# Altium schematic sheet 03-MCU_INTERFACE.SchDoc
size A3
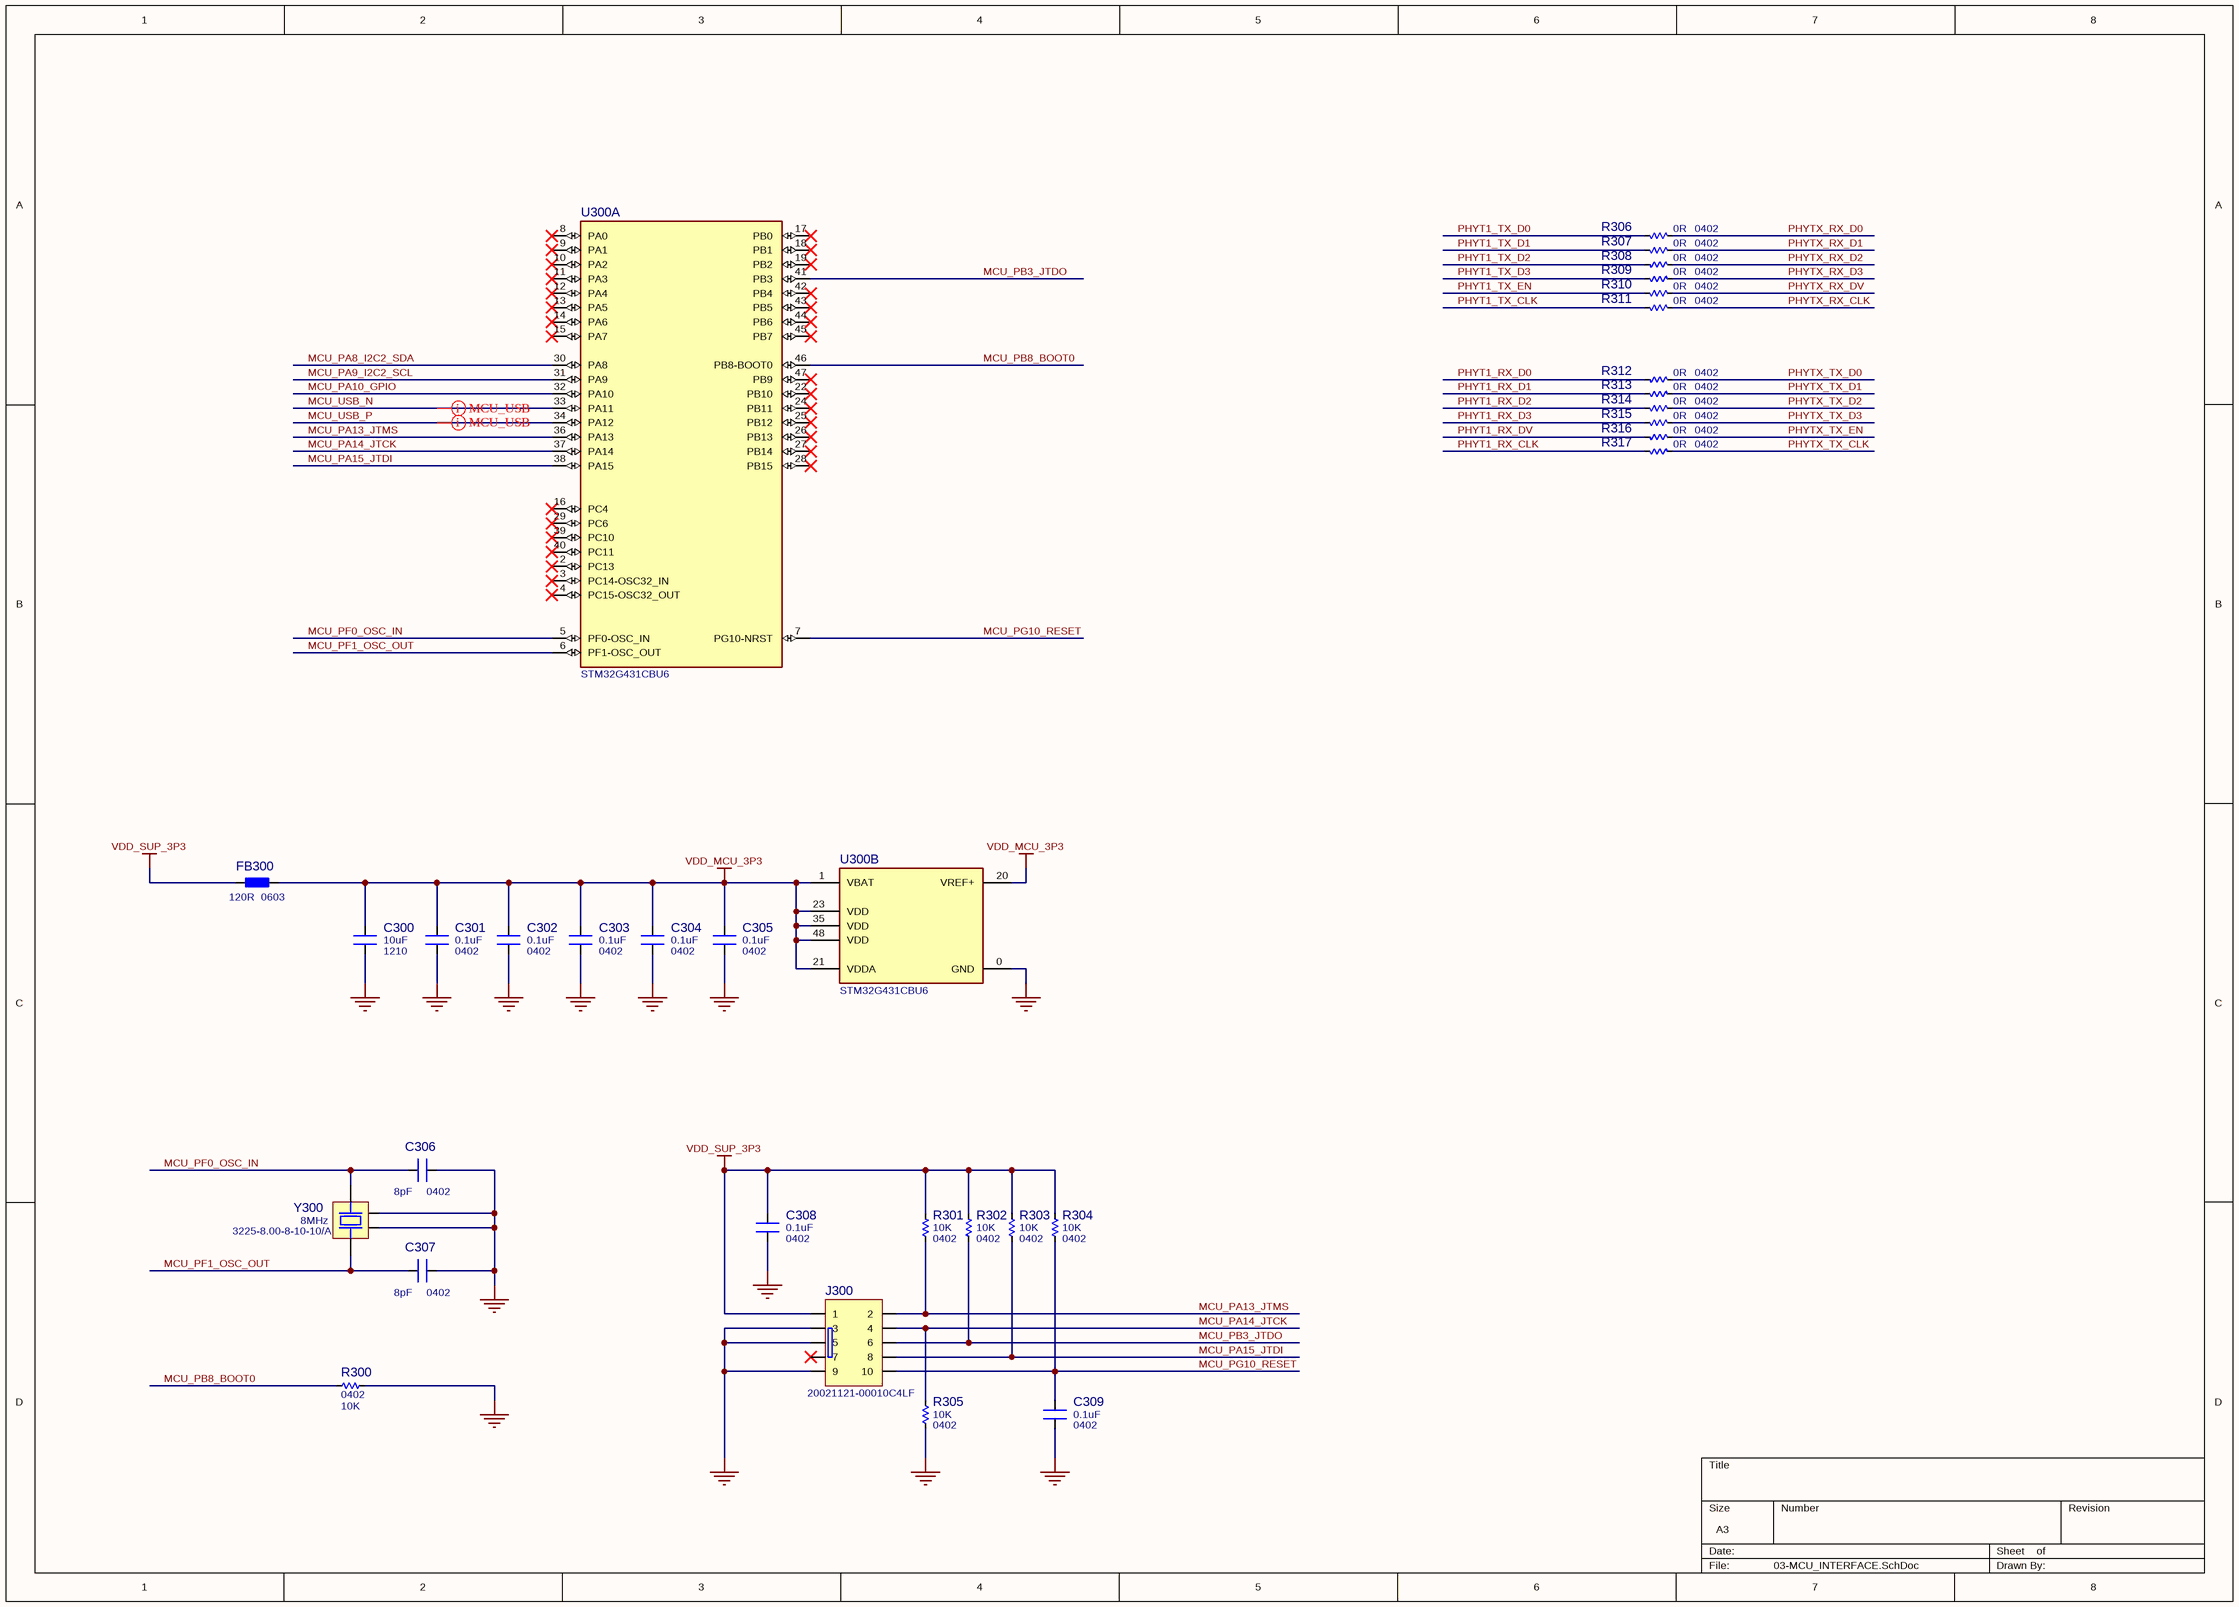
[diagram p0: 03-MCU_INTERFACE.SchDoc]

## Parts
C300  value 10uF  Package: 1210  [CAP_C_1210]  (hidden comment: Capacitor NP)
C301  value 0.1uF  Package: 0402  [CAP_C_0402]  (hidden comment: Capacitor NP)
C302  value 0.1uF  Package: 0402  [CAP_C_0402]  (hidden comment: Capacitor NP)
C303  value 0.1uF  Package: 0402  [CAP_C_0402]  (hidden comment: Capacitor NP)
C304  value 0.1uF  Package: 0402  [CAP_C_0402]  (hidden comment: Capacitor NP)
C305  value 0.1uF  Package: 0402  [CAP_C_0402]  (hidden comment: Capacitor NP)
C306  value 8pF  Package: 0402  [CAP_C_0402]  (hidden comment: Capacitor NP)
C307  value 8pF  Package: 0402  [CAP_C_0402]  (hidden comment: Capacitor NP)
C308  value 0.1uF  Package: 0402  [CAP_C_0402]  (hidden comment: Capacitor NP)
C309  value 0.1uF  Package: 0402  [CAP_C_0402]  (hidden comment: Capacitor NP)
FB300  value 120R  Package: 0603  [IND_C_0603]  (hidden comment: Ferrite bead)
J300  Manufacturer Part Number: 20021121-00010C4LF  [IDE_1.27-SMD-10V_2]  (hidden comment: IDE_10P)
R300  value 10K  Package: 0402  [RES_C_0402]  (hidden comment: Resistor)
R301  value 10K  Package: 0402  [RES_C_0402]  (hidden comment: Resistor)
R302  value 10K  Package: 0402  [RES_C_0402]  (hidden comment: Resistor)
R303  value 10K  Package: 0402  [RES_C_0402]  (hidden comment: Resistor)
R304  value 10K  Package: 0402  [RES_C_0402]  (hidden comment: Resistor)
R305  value 10K  Package: 0402  [RES_C_0402]  (hidden comment: Resistor)
R306  value 0R  Package: 0402  [RES_C_0402]  (hidden comment: Resistor)
R307  value 0R  Package: 0402  [RES_C_0402]  (hidden comment: Resistor)
R308  value 0R  Package: 0402  [RES_C_0402]  (hidden comment: Resistor)
R309  value 0R  Package: 0402  [RES_C_0402]  (hidden comment: Resistor)
R310  value 0R  Package: 0402  [RES_C_0402]  (hidden comment: Resistor)
R311  value 0R  Package: 0402  [RES_C_0402]  (hidden comment: Resistor)
R312  value 0R  Package: 0402  [RES_C_0402]  (hidden comment: Resistor)
R313  value 0R  Package: 0402  [RES_C_0402]  (hidden comment: Resistor)
R314  value 0R  Package: 0402  [RES_C_0402]  (hidden comment: Resistor)
R315  value 0R  Package: 0402  [RES_C_0402]  (hidden comment: Resistor)
R316  value 0R  Package: 0402  [RES_C_0402]  (hidden comment: Resistor)
R317  value 0R  Package: 0402  [RES_C_0402]  (hidden comment: Resistor)
U300  STM32G431CBU6  [QFN50P700X700X100_HS-49N]  (parts A,B of 2)
Y300  Manufacturer Part Number: 3225-8.00-8-10-10/A  Frequency: 8MHz  [XT-SMD-3225-4P]  (hidden comment: Crystal)

## Nets
GND: C300.1 C301.1 C302.1 C303.1 C304.1 C305.1 C306.1 C307.1 C308.1 C309.1 J300.3 J300.5 J300.9 R300.2 R305.2 U300.0(GND) Y300.2 Y300.4
VDD_MCU_3P3: C300.2 C301.2 C302.2 C303.2 C304.2 C305.2 FB300.1 U300.1(VBAT) U300.20(VREF+) U300.21(VDDA) U300.23(VDD) U300.35(VDD) U300.48(VDD)
VDD_SUP_3P3: C308.2 FB300.2 J300.1 R301.1 R302.1 R303.1 R304.1
MCU_PA8_I2C2_SDA: U300.30(PA8)
MCU_PA9_I2C2_SCL: U300.31(PA9)
MCU_PA10_GPIO: U300.32(PA10)
MCU_PA13_JTMS: J300.2 R301.2 U300.36(PA13)
MCU_PA14_JTCK: J300.4 R305.1 U300.37(PA14)
MCU_PA15_JTDI: J300.8 R303.2 U300.38(PA15)
MCU_PB3_JTDO: J300.6 R302.2 U300.41(PB3)
MCU_PB8_BOOT0: R300.1 U300.46(PB8-BOOT0)
MCU_PF0_OSC_IN: C306.2 U300.5(PF0-OSC_IN) Y300.1
MCU_PF1_OSC_OUT: C307.2 U300.6(PF1-OSC_OUT) Y300.3
MCU_PG10_RESET: C309.2 J300.10 R304.2 U300.7(PG10-NRST)
MCU_USB_N: U300.33(PA11)
MCU_USB_P: U300.34(PA12)
PHYT1_RX_CLK: R317.2
PHYT1_RX_D0: R312.2
PHYT1_RX_D1: R313.2
PHYT1_RX_D2: R314.2
PHYT1_RX_D3: R315.2
PHYT1_RX_DV: R316.2
PHYT1_TX_CLK: R311.2
PHYT1_TX_D0: R306.2
PHYT1_TX_D1: R307.2
PHYT1_TX_D2: R308.2
PHYT1_TX_D3: R309.2
PHYT1_TX_EN: R310.2
PHYTX_RX_CLK: R311.1
PHYTX_RX_D0: R306.1
PHYTX_RX_D1: R307.1
PHYTX_RX_D2: R308.1
PHYTX_RX_D3: R309.1
PHYTX_RX_DV: R310.1
PHYTX_TX_CLK: R317.1
PHYTX_TX_D0: R312.1
PHYTX_TX_D1: R313.1
PHYTX_TX_D2: R314.1
PHYTX_TX_D3: R315.1
PHYTX_TX_EN: R316.1

Not connected (* = marked no-connect by the designer): J300 7*; U300 2(PC13)* 3(PC14-OSC32_IN)* 4(PC15-OSC32_OUT)* 8(PA0)* 9(PA1)* 10(PA2)* 11(PA3)* 12(PA4)* 13(PA5)* 14(PA6)* 15(PA7)* 16(PC4)* 17(PB0)* 18(PB1)* 19(PB2)* 22(PB10)* 24(PB11)* 25(PB12)* 26(PB13)* 27(PB14)* 28(PB15)* 29(PC6)* 39(PC10)* 40(PC11)* 42(PB4)* 43(PB5)* 44(PB6)* 45(PB7)* 47(PB9)*

## Layout directives
differential pair; net class NC_DIFFPAIR_90R_USB; differential pair class DIFFPAIR_90R_USB: MCU_USB_N, MCU_USB_P

## Library data of the parts
C300 = Cap: Ceramic Capacitor SMD 1210 10uF ±10% 25V; Manufacturer: Samsung; Manufacturer Part Number: CL32B106KAJNNNE; Temperature Coeffcient: -55 to 85℃; Revision: 0; Tolerance: ±10%; ComponentLink1URL: http://product.samsungsem.com/mlcc/CL05A105KA5NQN.do; ComponentLink1Description: SVN Datasheet; ComponentLink2URL: *; ComponentLink2Description: Local Datasheet; ComponentLink3URL: D:\Altium\Library\AS50 library\AS50.SchLib; ComponentLink3Description: Open Symbol; ComponentLink4URL: D:\Altium\Library\AS50 library\Capacitors.PcbLib; ComponentLink4Description: Open Footprint; ComponentLink5Description: Open Footprint 2; ComponentLink6Description: Open Footprint 3; ComponentLink7Description: Open Footprint 4; Category: Capacitor; Voltage: 25V; Supplier 1: LCSC; Supplier Part Number 1: C39232
C301-C305 C308 C309 = Cap: Ceramic Capacitor SMD 0402 100nF ±10% 16V; Manufacturer: Samsung; Manufacturer Part Number: CL05B104KO5NNNC; Temperature Coeffcient: -55 to 85℃; Revision: 0; Tolerance: ±10%; ComponentLink1URL: http://product.samsungsem.com/mlcc/CL05B104KO5NNN.do; ComponentLink1Description: SVN Datasheet; ComponentLink2URL: *; ComponentLink2Description: Local Datasheet; ComponentLink3URL: D:\Altium\Library\AS50 library\AS50.SchLib; ComponentLink3Description: Open Symbol; ComponentLink4URL: D:\Altium\Library\AS50 library\Capacitors.PcbLib; ComponentLink4Description: Open Footprint; ComponentLink5Description: Open Footprint 2; ComponentLink6Description: Open Footprint 3; ComponentLink7Description: Open Footprint 4; Category: Capacitor; Voltage: 16V; Supplier 1: LCSC; Supplier Part Number 1: C1525
C306 C307 = Cap: Ceramic Capacitor SMD 0402 8pF ±0.25pF 50V; Manufacturer: Yageo; Manufacturer Part Number: CC0402CRNPO9BN8R0; Temperature Coeffcient: -55 to 85℃; Revision: 0; Tolerance: ±0.25pF; ComponentLink1URL: https://www.yageo.com/upload/media/product/products/datasheet/mlcc/UPY-GP_NP0_16V-to-50V_18.pdf; ComponentLink1Description: SVN Datasheet; ComponentLink2URL: *; ComponentLink2Description: Local Datasheet; ComponentLink3URL: D:\Altium\Library\AS50 library\AS50.SchLib; ComponentLink3Description: Open Symbol; ComponentLink4URL: D:\Altium\Library\AS50 library\Capacitors.PcbLib; ComponentLink4Description: Open Footprint; ComponentLink5Description: Open Footprint 2; ComponentLink6Description: Open Footprint 3; ComponentLink7Description: Open Footprint 4; Category: Capacitor; Voltage: 50V; Supplier 1: LCSC; Supplier Part Number 1: C130118
FB300 = Ferrite bead: Ferrite bead SMD 0603 120Ω ±25% @ 100MHz DCR=0.03Ω 3A; Manufacturer: Murata Electronics; Manufacturer Part Number: BLM18KG121TH1D; Category: Ferrite Bead; Tolerance: 25%; Frequency: 100MHz; DC Current: 3A; ComponentLink1URL: https://www.sunlordinc.com/Download.aspx?file=L1VwbG9hZEZpbGVzL1BERl9DYXQvMjAyMTA5MDcxNDU1NTM2OC5wZGY=&lan=en; ComponentLink1Description: SVN Datasheet; ComponentLink2URL: *; ComponentLink2Description: Local Datasheet; ComponentLink3URL: D:\Altium\Library\AS50 library\AS50.SchLib; ComponentLink3Description: Open Symbol; ComponentLink4URL: D:\Altium\Library\AS50 library\Inductors.PcbLib; ComponentLink4Description: Open Footprint; Supplier 1: LCSC; Supplier Part Number 1: C437404
J300 = IDE_10P: Conn Unshrouded Header HDR 10 POS 1.27mm Solder ST Top Entry SMD Tube; Manufacturer: Amphenol ICC; Category: Headers; ComponentLink1URL: https://cdn.amphenol-cs.com/media/wysiwyg/files/drawing/20021121.pdf; ComponentLink1Description: SVN Datasheet; ComponentLink2URL: *; ComponentLink2Description: Local Datasheet; ComponentLink3URL: D:\Altium\Library\AS50 library\AS50.SchLib; ComponentLink3Description: Open Symbol; ComponentLink4URL: D:\Altium\Library\AS50 library\Terminals.PcbLib; ComponentLink4Description: Open Footprint; Supplier 1: LCSC; Supplier Part Number 1: C150517
R300-R305 = Res: Resistor SMD 0402 10K ±1% 1/16W; Manufacturer: UNI-ROYAL(Uniroyal Elec); Manufacturer Part Number: 0402WGF1002TCE; Voltage: 50V; Temperature Coeffcient: ±100ppm/C; Tolerance: ±1%; Revision: 0; ComponentLink1URL: http://uni-royal.cn/images/userfile/file/1590821906c56505e6d9ab55c7.pdf; ComponentLink1Description: SVN Datasheet; ComponentLink2URL: *; ComponentLink2Description: Local Datasheet; ComponentLink3URL: D:\Altium\Library\AS50 library\AS50.SchLib; ComponentLink3Description: Open Symbol; ComponentLink4URL: D:\Altium\Library\AS50 library\Resistors.PcbLib; ComponentLink4Description: Open Footprint; ComponentLink5Description: Open Footprint 2; ComponentLink6Description: Open Footprint 3; ComponentLink7Description: Open Footprint 4; Operating Temperature: -55C to +155C; Category: Resistor; Power: 1/16W; Supplier 1: LCSC; Supplier Part Number 1: C25744
R306-R317 = Res: Resistor SMD 0402 0R ±1% 1/16W; Manufacturer: UNI-ROYAL(Uniroyal Elec); Manufacturer Part Number: 0402WGF0000TCE; Voltage: 50V; Temperature Coeffcient: ±100ppm/C; Tolerance: ±1%; Revision: 0; ComponentLink1URL: http://uni-royal.cn/images/userfile/file/1590821906c56505e6d9ab55c7.pdf; ComponentLink1Description: SVN Datasheet; ComponentLink2URL: *; ComponentLink2Description: Local Datasheet; ComponentLink3URL: D:\Altium\Library\AS50 library\AS50.SchLib; ComponentLink3Description: Open Symbol; ComponentLink4URL: D:\Altium\Library\AS50 library\Resistors.PcbLib; ComponentLink4Description: Open Footprint; ComponentLink5Description: Open Footprint 2; ComponentLink6Description: Open Footprint 3; ComponentLink7Description: Open Footprint 4; Operating Temperature: -55C to +155C; Category: Resistor; Power: 1/16W; Supplier 1: LCSC; Supplier Part Number 1: C17168
U300 = STM32G431CBU6: Arm® Cortex®-M4 32-bit MCU+FPU, 170 MHz /213 DMIPS, up to 128 KB Flash, 32 KB SRAM, rich analog, math accelerator; Manufacturer: STMicroelectronics; Category: ICs; Manufacturer Part Number: STM32G431CBU6; Supplier 1: Digikey; Supplier Part Number 1: 497-19475-ND
Y300 = CX3225SB12000H0PSTC1: 8MHz SMD Crystal Resonator 8pF ±10ppm ±20ppm -20℃~+70℃ SMD3225-4P; Manufacturer: Suzhou Liming Elec; Supplier 1: LCSC; Category: Crystals; ComponentLink1URL: https://datasheet.lcsc.com/lcsc/2008261838_Suzhou-Liming-Elec-3225-8-00-8-10-10-A_C518135.pdf; ComponentLink1Description: SVD Datasheet; ComponentLink2URL: *; ComponentLink2Description: Local Datasheet; Supplier Part Number 1: C518135; ComponentLink3Description: Open Symbol; ComponentLink3URL: D:\Altium\Library\AS50 library\AS50.SchLib; ComponentLink4Description: Open Footprint; ComponentLink4URL: D:\Altium\Library\AS50 library\Crystals.PcbLib